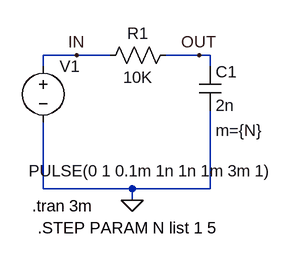
[diagram p0: schematic Fig_2-87_Cap_Param_N.asc]
Fig_2-87_Cap_Param_N.asc, the LTspice schematic file:
Version 4
SHEET 1 880 680
WIRE -48 80 -96 80
WIRE 0 80 -48 80
WIRE 128 80 80 80
WIRE 144 80 128 80
WIRE -96 96 -96 80
WIRE 144 96 144 80
WIRE -96 272 -96 176
WIRE 32 272 -96 272
WIRE 144 272 144 160
WIRE 144 272 32 272
WIRE 32 288 32 272
FLAG 32 288 0
FLAG 128 80 OUT
FLAG -48 80 IN
SYMBOL cap 128 96 R0
WINDOW 123 24 92 Left 2
SYMATTR Value2 m={N}
SYMATTR InstName C1
SYMATTR Value 2n
SYMBOL res -16 96 R270
WINDOW 0 32 56 VTop 2
WINDOW 3 0 56 VBottom 2
SYMATTR InstName R1
SYMATTR Value 10K
SYMBOL voltage -96 80 R0
WINDOW 3 -21 166 Left 2
WINDOW 123 0 0 Left 2
WINDOW 39 0 0 Left 2
SYMATTR Value PULSE(0 1 0.1m 1n 1n 1m 3m 1)
SYMATTR InstName V1
TEXT -112 296 Left 2 !.tran 3m
TEXT -104 328 Left 2 !.STEP PARAM N list 1 5

The netlist it stands for:
* Fig_2-87_Cap_Param_N.asc
C1 OUT 0 2n m={N}
R1 IN OUT 10K
V1 IN 0 PULSE(0 1 0.1m 1n 1n 1m 3m 1)
.tran 3m
.STEP PARAM N list 1 5
.backanno
.end